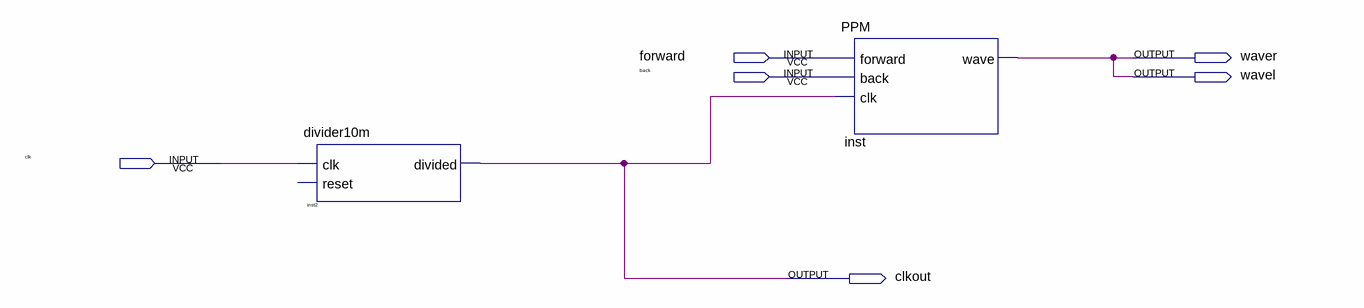
[diagram p0: schematic sheet]
// Quartus schematic TOP.bdf as structural Verilog: 2 symbols, 6 pins
module TOP (
  input  forward,
  input  back,
  input  clk,
  output waver,
  output wavel,
  output clkout
);

  divider10m inst2 (.clk(clk), .divided(clkout));  // open: reset
  PPM inst (.forward(forward), .back(back), .clk(clkout), .wave(wavel));

  assign waver = wavel;
endmodule
